# Altium schematic sheet esp32.SchDoc
size A; SheetNumber: 1; SheetTotal: 1
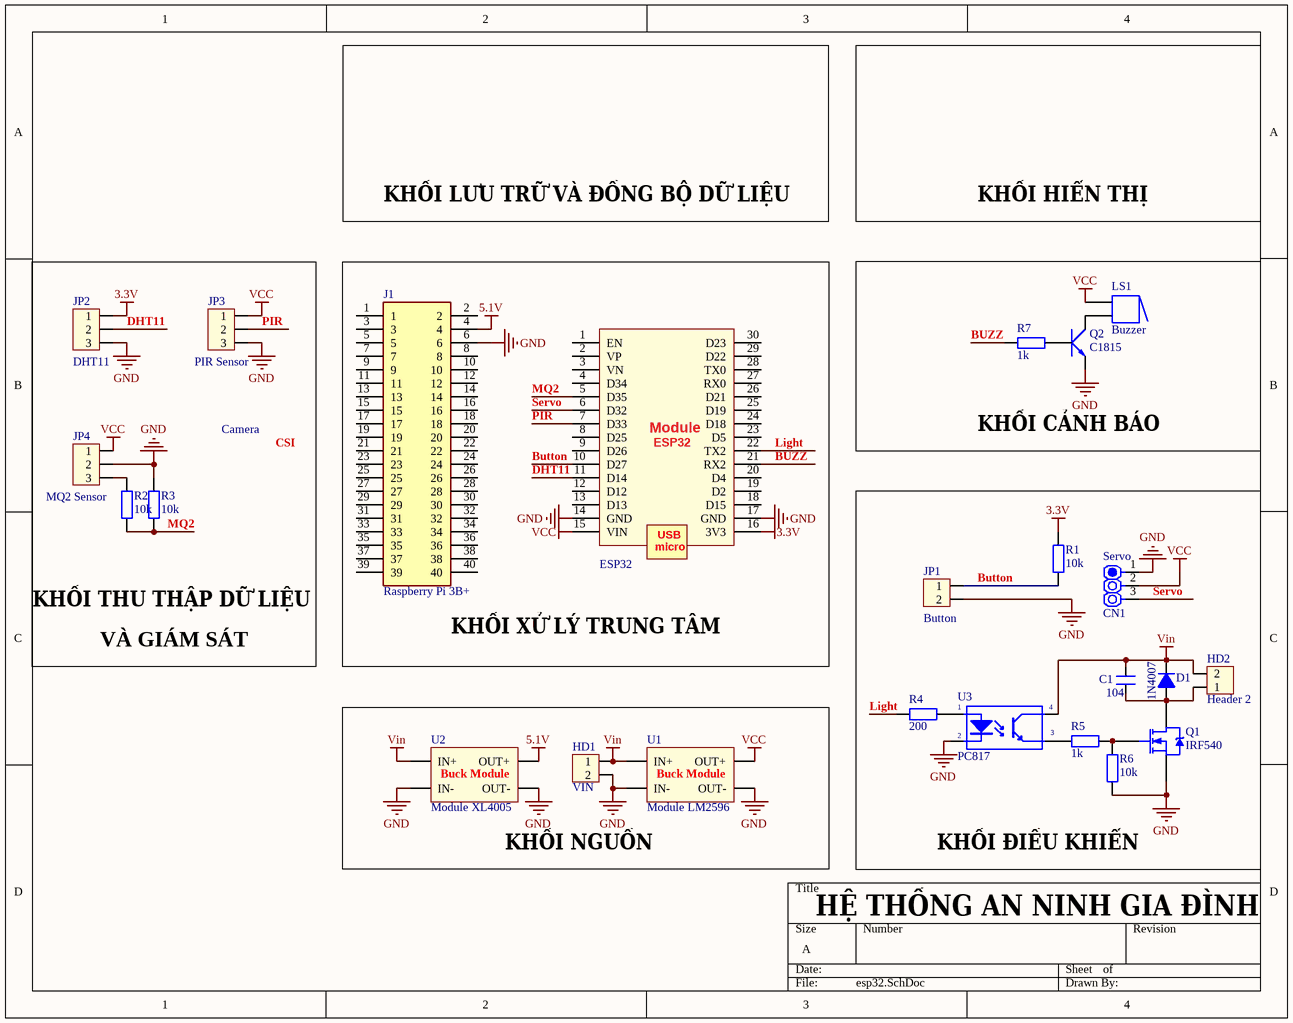
[diagram p0: esp32.SchDoc]

## Parts
C1  104  [CN3]
CN1  Servo  [CON.HDR1X3]
D1  1N4007  [D1A]
ESP32  ESP32_Dev_Module  [ESP32_Dev_Module]  (value not drawn)
HD1  VIN  [HED2]
HD2  Header 2  [HED2]
J1  Raspberry Pi 3B+  [2187]
JP1  Button  [CON2]
JP2  DHT11  [CON3]
JP3  PIR Sensor  [CON3]
JP4  MQ2 Sensor  [CON3]
LS1  Buzzer  [Buzzer]
Q1  IRF540  [TO-220-3]
Q2  C1815  [QTO-92]
R1  10k  [R1/4W]
R2  10k  [R1/4W]
R3  10k  [R1/4W]
R4  200  [R1/4W]
R5  1k  [R1/4W]
R6  10k  [R1/4W]
R7  1k  [R1/4W]
U1  Module LM2596  [Buck LM2596 Module]
U2  Module XL4005  [Buck XL4015 Module]
U3  PC817  [DIP4/W0.3]

## Nets
3.3V: ESP32.16(3V3) JP2.1 R1.2
5.1V: J1.4 U2.2(OUT+)
GND: CN1.1 ESP32.14(GND) ESP32.17(GND) HD1.2 J1.6 JP1.2 JP2.3 JP3.3 JP4.2 Q1.3(S) Q2.1(E) R3.2 R6.1 U1.3(IN-) U1.4(OUT-) U2.3(IN-) U2.4(OUT-) U3.2(K)
VCC: CN1.2 ESP32.15(VIN) JP3.1 JP4.1 LS1.1 U1.2(OUT+)
Vin: C1.2 D1.2(K) HD1.1 HD2.2 U1.1(IN+) U2.1(IN+) U3.4(C)
Button: ESP32.10(D27) JP1.1 R1.1
BUZZ: ESP32.21(RX2) R7.1
DHT11: ESP32.11(D14) JP2.2
Light: ESP32.22(TX2) R4.1
MQ2: ESP32.5(D35) R2.1 R3.1
PIR: ESP32.7(D33) JP3.2
Servo: CN1.3 ESP32.6(D32)
NetC1_1: C1.1 D1.1(A) HD2.1 Q1.2(D)
NetJP4_3: JP4.3 R2.2
NetLS1_2: LS1.2 Q2.2(C)
NetQ1_1: Q1.1(G) R5.2 R6.2
NetQ2_3: Q2.3(B) R7.2
NetR4_2: R4.2 U3.1(A)
NetR5_1: R5.1 U3.3(E)

Not connected (* = marked no-connect by the designer): ESP32 1(EN) 2(VP) 3(VN) 4(D34) 8(D25) 9(D26) 12(D12) 13(D13) 18(D15) 19(D2) 20(D4) 23(D5) 24(D18) 25(D19) 26(D21) 27(RX0) 28(TX0) 29(D22) 30(D23); J1 1 2 3 5 7 8 9 10 11 12 13 14 15 16 17 18 19 20 21 22 23 24 25 26 27 28 29 30 31 32 33 34 35 36 37 38 39 40

## Notes on the sheet
- KHỐI LƯU TRỮ VÀ ĐỒNG BỘ DỮ LIỆU
- KHỐI HIỂN THỊ
- Camera
- KHỐI CẢNH BÁO
- KHỐI THU THẬP DỮ LIỆU
- (near J1) KHỐI XỬ LÝ TRUNG TÂM
- VÀ GIÁM SÁT
- KHỐI NGUỒN
- (near R6) KHỐI ĐIỀU KHIỂN
- HỆ THỐNG AN NINH GIA ĐÌNH
- Labels drawn without touching a wire or pin: CSI
- (in symbol ESP32_Dev_Module) Module; USB; micro

## Library data of the parts
C1 = CN3: Cap np W0.3; Value: 0,047uF; Copyright: VanDungEvn
CN1 = CON.HDR1x3: Header 1x3; Publisher: Hoang Nguyen; ComponentLink1Description: Digikey Part link; ComponentLink2Description: Open DataSheet; ComponentLink2URL: H:\LIBRARY\LIBRARY.Datasheet\
D1 = D1A: Diode 1A; Value: 1N4007
HD1 HD2 = Hed2: Header 2 (Green); Value: Header 2
J1 = 2187: Connector; Manufacturer_Name: Adafruit; Datasheet Link: https://cdn-shop.adafruit.com/product-files/2187/CS25582-40G-M36-0A+(1).jpg; Height: 4mm; Manufacturer_Part_Number: 2187; Mouser Part Number: 485-2187; Mouser Price/Stock: https://www.mouser.co.uk/ProductDetail/Adafruit/2187?qs=GURawfaeGuDhxAiRkSwRmQ%3D%3D; Arrow Part Number: 2187; Arrow Price/Stock: https://www.arrow.com/en/products/2187/adafruit-industries?region=nac
JP1 = Con2: Connector 2; Value: Connector 2
JP2-JP4 = Con3: Connector 3; Value: Connector 3
LS1 = Buzzer: Magnetic Transducer Buzzer; Published: 24-Mar-1999; LatestRevisionDate: 17-Dec-2003; LatestRevisionNote: Schematic revised, PCB Footprint replaced.; DatasheetDocument: 17-Dec-2003; PackageReference: ABSM-1574; Publisher: Altium Limited; ComponentLink1Description: Manufacturer Link; ComponentLink1URL: http://www.megastar.com/linecard/buzzmode/index.php
Q1 = IRF540: HEXFET N-Channel Power MOSFET; Note: Pin 2 is electrically connected to pin 4.; Published: 8-Jun-2000; LatestRevisionDate: 17-Jul-2002; LatestRevisionNote: Re-released for DXP Platform.; DatasheetVersion: PD-9.373H; PackageVersion: Feb-1997; PackageReference: TO-220AB; Publisher: Altium Limited; PackageDescription: TO, Thru-Hole, Vertical, Heatsink Mounted; 3 In-Line Leads; Pitch 2.54 mm; ComponentLink1Description: Manufacturer Link; ComponentLink1URL: http://www.irf.com/
Q2 = C1815_1: NPN 600mW, ECB; Value: C1815
R1-R7 = R1/4W: Resistor 1/4W; Value: R1/4W - 1K
U1 U2 = Buck_Module: Buck Module
U3 = PC817_1: Single Opto; Value: PC817